# EAGLE design valentines-heart-punk-r1.2 (EAGLE 5.12)
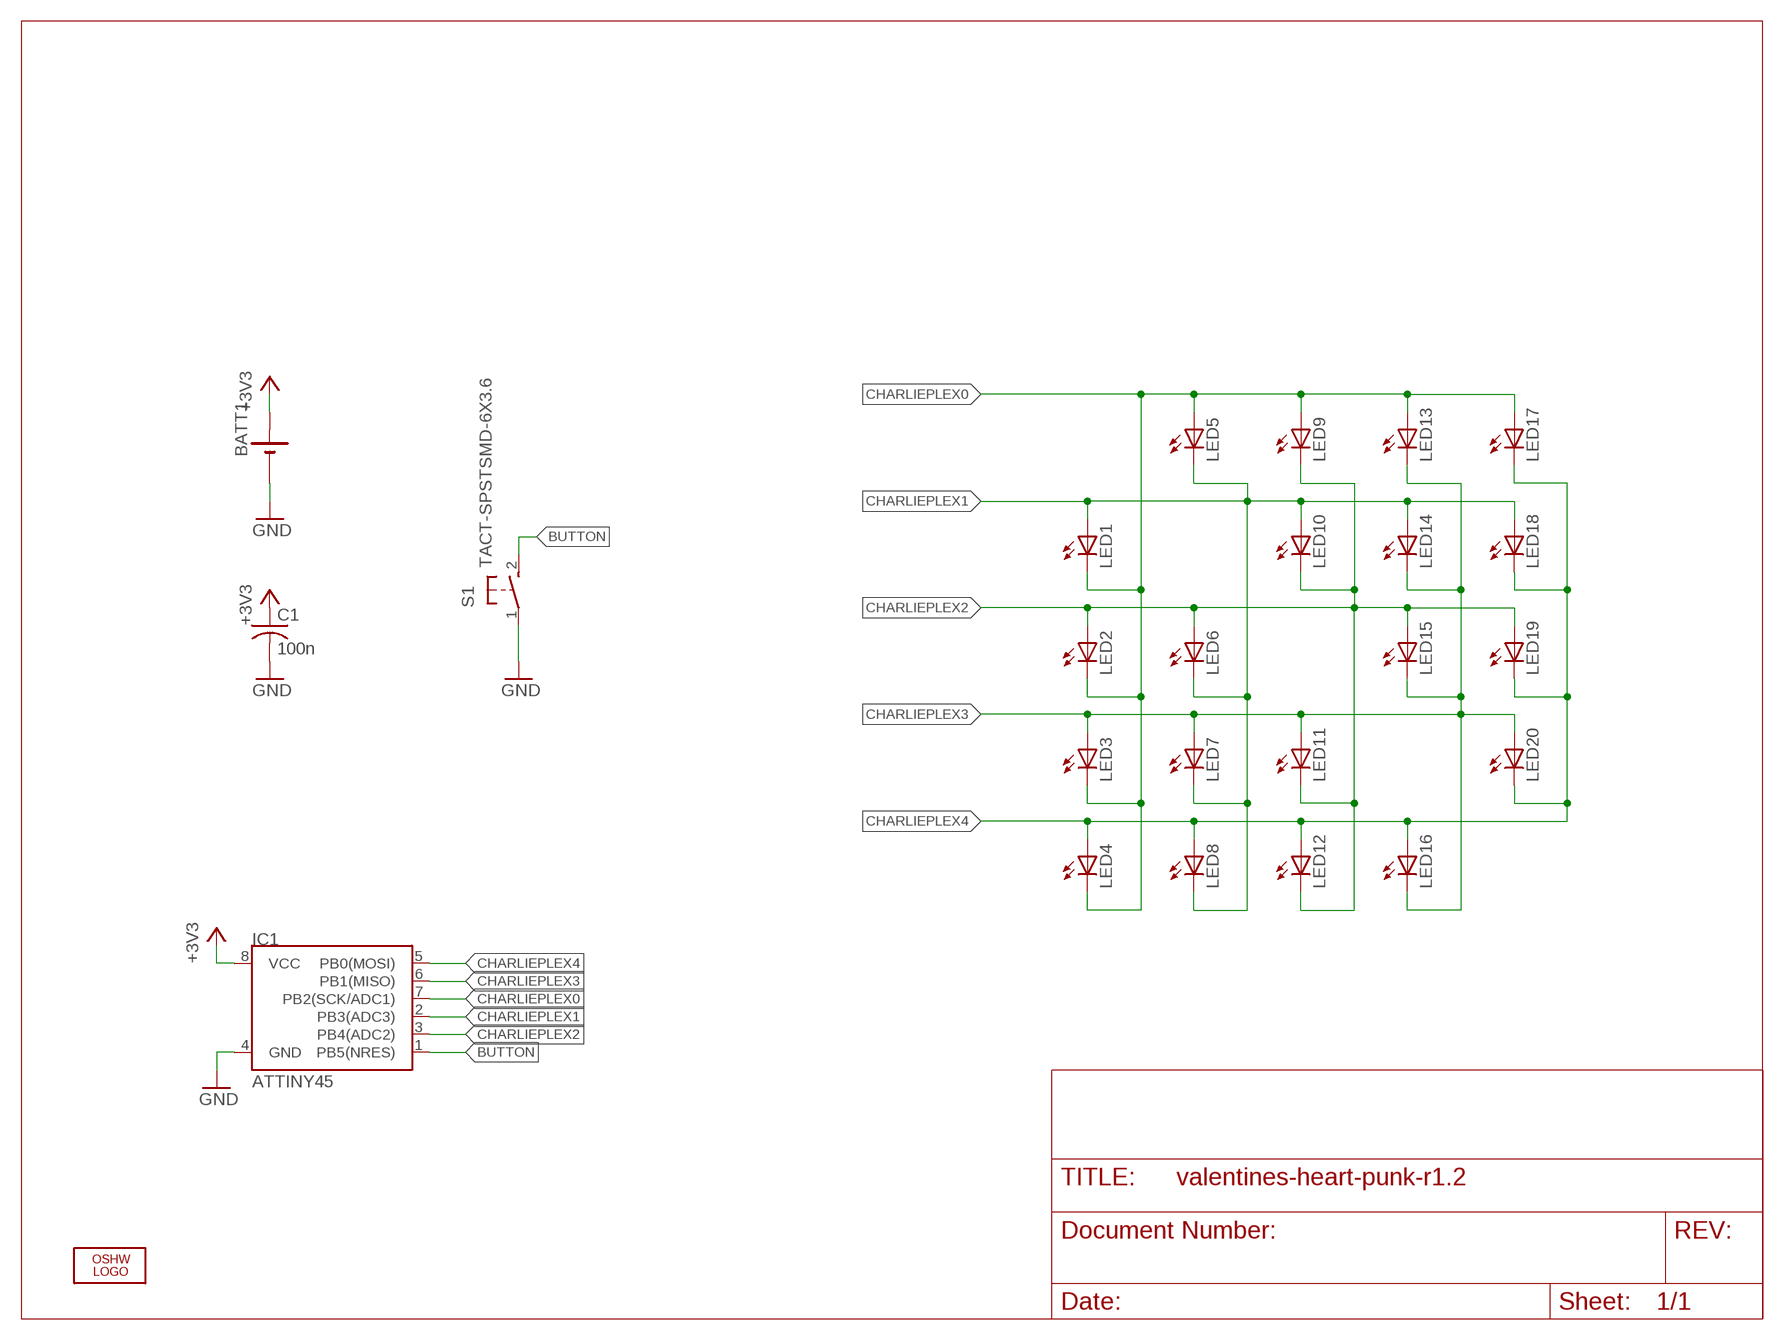
[diagram p0: schematic, sheet 1]

## Parts
BATT1  2032SMD  [2032SMD]
C1  100n  C-USC1206  [C1206]
IC1  ATTINY45  [SO08-EIAJ]
LED1  LEDCHIPLED_1206  [CHIPLED_1206]
LED2  LEDCHIPLED_1206  [CHIPLED_1206]
LED3  LEDCHIPLED_1206  [CHIPLED_1206]
LED4  LEDCHIPLED_1206  [CHIPLED_1206]
LED5  LEDCHIPLED_1206  [CHIPLED_1206]
LED6  LEDCHIPLED_1206  [CHIPLED_1206]
LED7  LEDCHIPLED_1206  [CHIPLED_1206]
LED8  LEDCHIPLED_1206  [CHIPLED_1206]
LED9  LEDCHIPLED_1206  [CHIPLED_1206]
LED10  LEDCHIPLED_1206  [CHIPLED_1206]
LED11  LEDCHIPLED_1206  [CHIPLED_1206]
LED12  LEDCHIPLED_1206  [CHIPLED_1206]
LED13  LEDCHIPLED_1206  [CHIPLED_1206]
LED14  LEDCHIPLED_1206  [CHIPLED_1206]
LED15  LEDCHIPLED_1206  [CHIPLED_1206]
LED16  LEDCHIPLED_1206  [CHIPLED_1206]
LED17  LEDCHIPLED_1206  [CHIPLED_1206]
LED18  LEDCHIPLED_1206  [CHIPLED_1206]
LED19  LEDCHIPLED_1206  [CHIPLED_1206]
LED20  LEDCHIPLED_1206  [CHIPLED_1206]
LOGO1  OSHW_LOGO_FILLX0100-NT  [OSHW_FILLX100_NOTEXT]
S1  TACT-SPSTSMD-6X3.6  [6X3.6-SPST]

## Nets
+3V3: BATT1.+ C1.1 IC1.8(VCC)
BUTTON: IC1.1(PB5(NRES)) S1.2(S)
CHARLIEPLEX0: IC1.7(PB2(SCK/ADC1)) LED1.C LED2.C LED3.C LED4.C LED5.A LED9.A LED13.A LED17.A
CHARLIEPLEX1: IC1.2(PB3(ADC3)) LED1.A LED5.C LED6.C LED7.C LED8.C LED10.A LED14.A LED18.A
CHARLIEPLEX2: IC1.3(PB4(ADC2)) LED2.A LED6.A LED9.C LED10.C LED11.C LED12.C LED15.A LED19.A
CHARLIEPLEX3: IC1.6(PB1(MISO)) LED3.A LED7.A LED11.A LED13.C LED14.C LED15.C LED16.C LED20.A
CHARLIEPLEX4: IC1.5(PB0(MOSI)) LED4.A LED8.A LED12.A LED16.A LED17.C LED18.C LED19.C LED20.C
GND: BATT1.- C1.2 IC1.4(GND) S1.1(P)

## Library data of the parts
BATT1 = rbg-4ucon-battery:2032SMD
C1 = rcl:C-US: CAPACITOR, American symbol
IC1 = SparkFun:ATTINY45: Atmel ATTiny45
LED1-LED20 = led:LED: LED OSRAM: - CHIPLED LG R971, LG N971, LY N971, LG Q971, LY Q971, LO R971, LY R971 LH N974, LH R974 LS Q976, LO Q976, LY Q976 LO Q996 - Hyper CHIPLED LW Q18S LB Q993, LB Q99A, LB R99A - SideLED LS A670, LO A670, LY A670, LG A670, LP A670 LB A673, LV A673, LT A673, LW A673 LH A674 LY A675 LS A676, LA A676, LO A676, LY A676, LW A676 LS A679, LY A679, LG A679 - Hyper Micro SIDELED® LS Y876, LA Y876, LO Y876, LY Y876 LT Y87S - SmartLED LW L88C, LW L88S LB L89C, LB L89S, LG L890 LS L89K, LO L89K, LY L89K LS L896, LA L896, LO L896, LY L896 - TOPLED LS T670, LO T670, LY T670, LG T670, LP T670 LSG T670, LSP T670, LSY T670, LOP T670, LYG T670 LG T671, LOG T671, LSG T671 LB T673, LV T673, LT T673, LW T673 LH T674 LS T676, LA T676, LO T676, LY T676, LB T676, LH T676, LSB T676, LW T676 LB T67C, LV T67C, LT T67C, LS T67K, LO T67K, LY T67K, LW E67C LS E67B, LA E67B, LO E67B, LY E67B, LB E67C, LV E67C, LT E67C LW T67C LS T679, LY T679, LG T679 LS T770, LO T770, LY T770, LG T770, LP T770 LB T773, LV T773, LT T773, LW T773 LH T774 LS E675, LA E675, LY E675, LS T675 LS T776, LA T776, LO T776, LY T776, LB T776 LHGB T686 LT T68C, LB T68C - Hyper Mini TOPLED® LB M676 - Mini TOPLED Santana® LG M470 LS M47K, LO M47K, LY M47K Source: http://www.osram.convergy.de LUXEON: - LUMILED® LXK2-PW12-R00, LXK2-PW12-S00, LXK2-PW14-U00, LXK2-PW14-V00 LXK2-PM12-R00, LXK2-PM12-S00, LXK2-PM14-U00 LXK2-PE12-Q00, LXK2-PE12-R00, LXK2-PE12-S00, LXK2-PE14-T00, LXK2-PE14-U00 LXK2-PB12-K00, LXK2-PB12-L00, LXK2-PB12-M00, LXK2-PB14-N00, LXK2-PB14-P00, LXK2-PB14-Q00 LXK2-PR12-L00, LXK2-PR12-M00, LXK2-PR14-Q00, LXK2-PR14-R00 LXK2-PD12-Q00, LXK2-PD12-R00, LXK2-PD12-S00 LXK2-PH12-R00, LXK2-PH12-S00 LXK2-PL12-P00, LXK2-PL12-Q00, LXK2-PL12-R00 Source: www.luxeon.com KINGBRIGHT: KA-3528ASYC Source: www.kingbright.com
LOGO1 = ohw-logo:OSHW_LOGO_FILL
S1 = rbg-generic-tact-switch:TACT-SPST

## Board
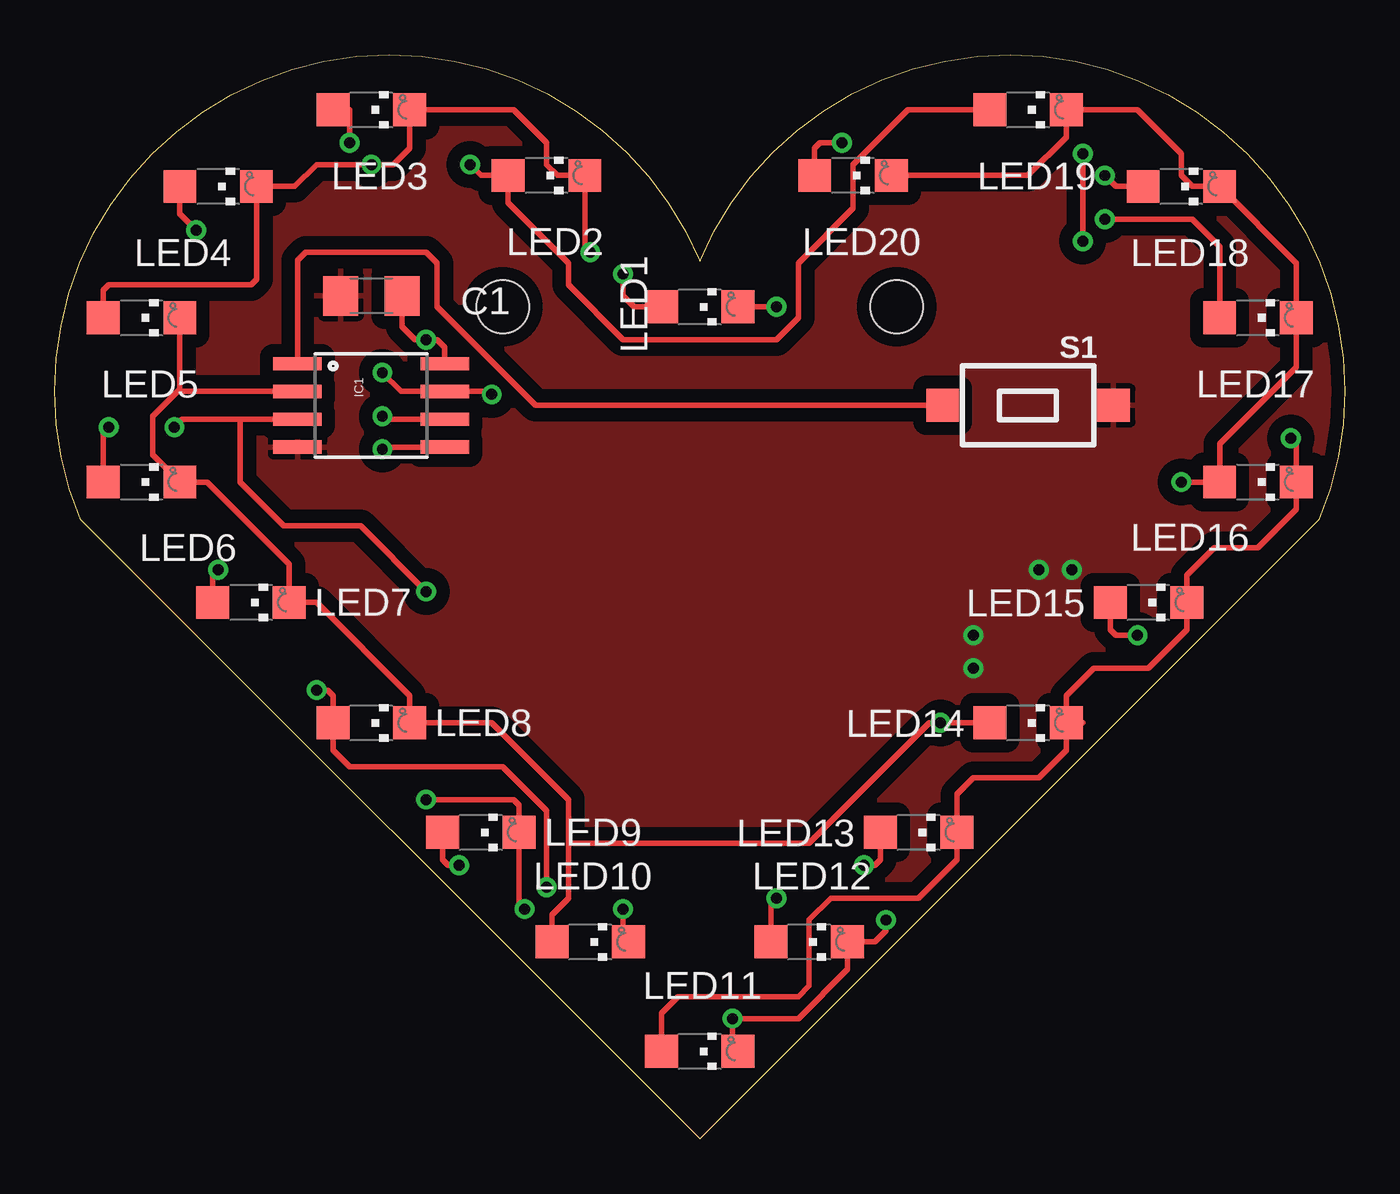
[diagram p1: board, top side]
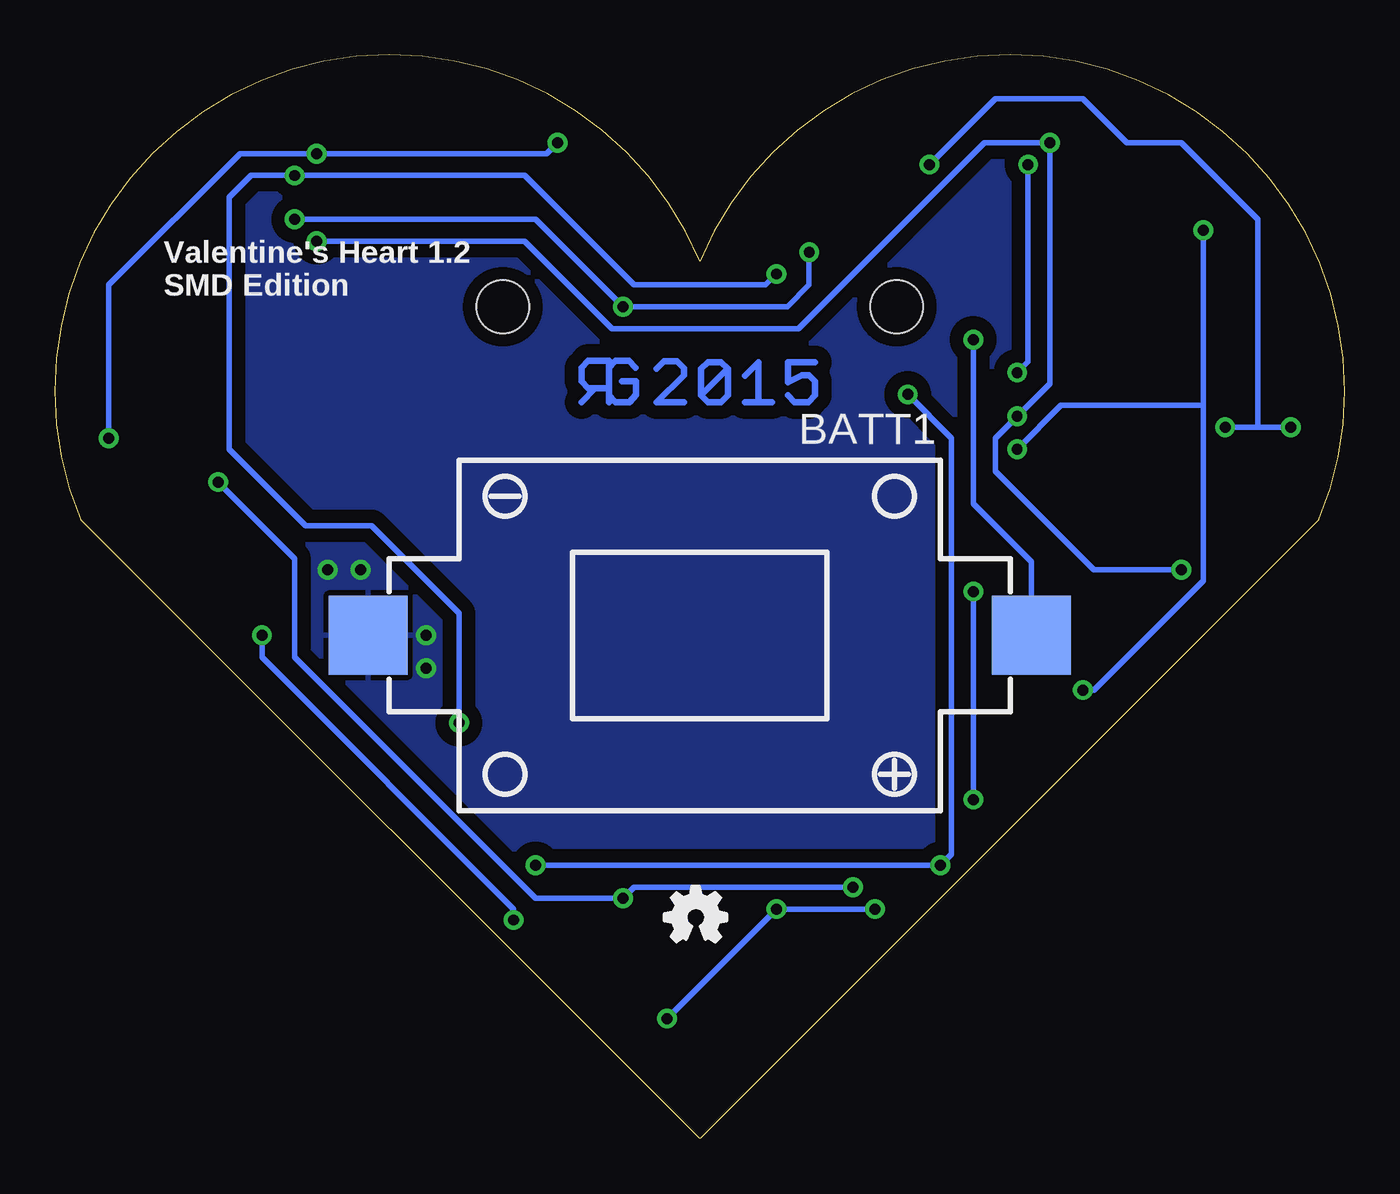
[diagram p2: board, bottom side, seen from below]

Size 58.93 x 49.51 mm. Coordinates in mm from the lower left corner, seen from the top.
Outline: 29.47,0 57.75,28.28 arc180 29.47,40.09 arc180 1.18,28.28 29.47,0
Copper layers (1*16): Top 0.035mm / dielectric 1.5mm / Bottom 0.035mm
Design rules "default *": minimum track width 10mil, minimum drill 0.5mm, track to track 10mil, track to pad 10mil, pad to pad 10mil, via to via 10mil, smd to smd 10mil, copper to edge 20mil, drill to drill 8mil, minimum pad ring 10mil, minimum via ring 8mil, stop-mask expansion 4mil, vias tented up to drill 20mil, thermal gap 10mil
Holes 2.4 mm at 20.47,38 38.47,38

### Footprints (pad centres in the part's own frame; a part is rotated, then mirrored left to right if it is on the bottom)
2032SMD = smd 3.6 x 3.6: + -15.15,0; - 15.15,0
C1206 = smd 1.6 x 1.8: 1 -1.4,0; 2 1.4,0
SO08-EIAJ = smd 0.61 x 2.21: 1 -1.905,-3.378; 2 -0.635,-3.378; 3 0.635,-3.378; 4 1.905,-3.378; 5 1.905,3.353; 6 0.635,3.353; 7 -0.635,3.353; 8 -1.905,3.353
CHIPLED_1206 = smd 1.5 x 1.5: A 0,-1.75; C 0,1.75
6X3.6-SPST = smd 1.5 x 1.5: 1 -3.9,0; 2 3.9,0

### Placement (x,y rotation side)
BATT1  29.47,23 180 bottom
C1  14.47,38.5 180 top
IC1  14.47,33.5 270 top
LED1  29.47,38 270 top
LED2  22.47,44 270 top
LED3  14.47,47 270 top
LED4  7.47,43.5 270 top
LED5  3.97,37.5 270 top
LED6  3.97,30 270 top
LED7  8.97,24.5 270 top
LED8  14.47,19 270 top
LED9  19.47,14 270 top
LED10  24.47,9 270 top
LED11  29.47,4 270 top
LED12  34.47,9 270 top
LED13  39.47,14 270 top
LED14  44.47,19 270 top
LED15  49.97,24.5 270 top
LED16  54.97,30 270 top
LED17  54.97,37.5 270 top
LED18  51.47,43.5 270 top
LED19  44.47,47 270 top
LED20  36.47,44 270 top
LOGO1  31.07,9 0 bottom
S1  44.47,33.5 180 top
U$1  [RGLOGO_SMALL_2015]  33.47,33.5 0 bottom

### Tracks (layer width: path | path; a pad name or v marks a point on that pad's centre or on a via)
+3V3  (via drill 0.5)
  Top 0.254: C1.1 15.87,37.1 16.47,36.5 v16.97,36.5 17.47,36.5 17.82,36.15 IC1.8
  Bottom 0.254: BATT1.+ 14.32,26.35 16.97,29 v16.97,36.5
BUTTON
  Top 0.254: S1.2 21.97,33.5 17.47,38 17.47,40 16.97,40.5 11.47,40.5 11.09,40.12 IC1.1
CHARLIEPLEX0  (via drill 0.5)
  Top 0.254: v47.97,42 51.97,42 53.22,40.75 LED17.A | LED9.A 17.72,12.75 17.97,12.5 v18.47,12.5 | LED5.A 2.22,38.75 2.47,39 8.97,39 9.22,39.25 LED4.C 10.97,43.5 11.97,44.5 v14.47,44.5 15.47,44.5 16.22,45.25 LED3.C 20.97,47 22.47,45.5 22.47,44.5 22.97,44 LED2.C 24.22,40.75 v24.47,40.5 | LED13.A 37.72,12.75 37.47,12.5 v36.97,12.5 | v19.97,34 19.83,34.13 IC1.7 15.83,34.13 v14.97,35 | v32.97,38 LED1.C
  Bottom 0.254: v36.97,12.5 v18.47,12.5 17.97,13 17.97,32 v19.97,34 | v47.97,42 36.97,42 v32.97,38 25.47,38 24.47,39 v24.47,40.5 | v14.97,35 14.47,35.5 v14.47,44.5
CHARLIEPLEX1  (via drill 0.5)
  Top 0.254: 23.47,13.5 23.47,15.5 19.97,19 LED8.C 16.22,20.25 11.97,24.5 LED7.C 10.72,26.25 6.97,30 LED6.C 4.47,31.25 4.47,33 5.61,34.15 | 23.47,13.5 34.47,13.5 39.97,19 v40.47,19 LED14.A | 23.47,13.5 23.47,11 22.72,10.25 LED10.A | LED18.A 48.47,43.5 v47.97,44 | IC1.2 5.62,34.13 5.61,34.15 | LED5.C 5.72,34.25 5.61,34.15 | v25.97,39.5 25.97,38.5 26.47,38 LED1.A
  Bottom 0.254: v40.47,19 40.47,24 44.47,28 47.47,28 50.97,31.5 50.97,43 49.97,44 v47.97,44 37.47,44 32.47,39 26.47,39 v25.97,39.5
CHARLIEPLEX2  (via drill 0.5)
  Top 0.254: v16.97,25 13.97,28 10.47,28 8.47,30 8.47,32.87 | v16.97,15.5 20.97,15.5 21.22,15.25 LED9.C 21.22,10.75 v21.47,10.5 | LED6.A 2.22,32.25 v2.47,32.5 | v18.97,44.5 19.47,44 LED2.A 20.72,42.75 20.97,42.5 23.47,40 23.47,39 25.97,36.5 32.97,36.5 33.97,37.5 33.97,40 36.47,42.5 36.47,44.5 38.97,47 LED19.A | v25.97,10.5 25.97,9.25 LED10.C | LED15.A 48.22,23.25 48.47,23 v49.47,23 | v37.97,10 37.97,9.5 37.47,9 LED12.C 36.22,7.75 33.97,5.5 v30.97,5.5 30.97,4.25 LED11.C | 8.47,32.87 IC1.3 | 8.47,32.87 5.83,32.87 v5.47,32.5
  Bottom 0.254: v2.47,32.5 3.97,32.5 | 3.97,32.5 v5.47,32.5 | v21.47,10.5 v25.97,10.5 v30.97,5.5 | v49.47,23 49.47,22 37.97,10.5 v37.97,10 | v18.97,44.5 15.97,47.5 11.97,47.5 9.97,45.5 7.47,45.5 3.97,42 3.97,32.5 | v16.97,25 v16.97,15.5
CHARLIEPLEX3  (via drill 0.5)
  Top 0.254: LED14.C 46.97,19 | v13.47,45.5 13.47,47 LED3.A | v46.97,45 v46.97,41 | LED7.A 7.22,25.75 v7.47,26 | v56.47,32 56.72,31.75 LED16.C 56.72,28.75 54.97,27 52.97,27 51.72,25.75 LED15.C 51.72,23.25 49.97,21.5 47.47,21.5 46.22,20.25 LED14.C | LED14.C 46.22,17.75 44.97,16.5 41.97,16.5 41.22,15.75 LED13.C 41.22,12.75 39.47,11 35.47,11 34.47,10 34.47,7 33.97,6.5 28.47,6.5 27.72,5.75 LED11.A | LED20.A 34.72,45.25 34.97,45.5 v35.97,45.5 | IC1.6 15.1,32.87 v14.97,33
  Bottom 0.254: v7.47,26 11.47,26 15.97,30.5 15.97,32 v14.97,33 13.47,34.5 v13.47,45.5 16.47,45.5 24.97,37 33.47,37 37.47,41 v46.97,41 | v56.47,32 56.47,39 50.47,45 v46.97,45 36.47,45 v35.97,45.5
CHARLIEPLEX4  (via drill 0.5)
  Top 0.254: v22.47,11.5 22.47,15 20.47,17 13.47,17 12.72,17.75 LED8.A 12.72,20.25 12.47,20.5 v11.97,20.5 | LED4.A 5.72,42.25 v6.47,41.5 | LED20.C 44.47,44 46.22,45.75 LED19.C 49.47,47 51.47,45 51.47,44 51.97,43.5 LED18.C 56.72,40 LED17.C 56.72,35.25 53.22,31.75 LED16.A v51.47,30 | LED12.A 32.72,10.75 v32.97,11 | IC1.5 15.06,31.59 v14.97,31.5
  Bottom 0.254: v11.97,20.5 11.47,20.5 6.47,25.5 6.47,33.5 | 6.47,33.5 v6.47,41.5 | v51.47,30 47.97,26.5 47.97,22 36.97,11 v32.97,11 32.47,11.5 v22.47,11.5 | v14.97,31.5 12.97,33.5 6.47,33.5
GND  (via drill 0.5)
  other vias: 46.47,26 44.97,26 41.97,23 41.97,21.5
  pour Bottom (isolate 0.61): -0.53,51 60.47,51 60.47,-4.5 -0.53,-4.5
  pour Top (isolate 0.61): -0.53,51 60.47,51 60.47,-4.5 -0.53,-4.5

### Text on the board
bNames: Valentine's Heart 1.2 | SMD Edition